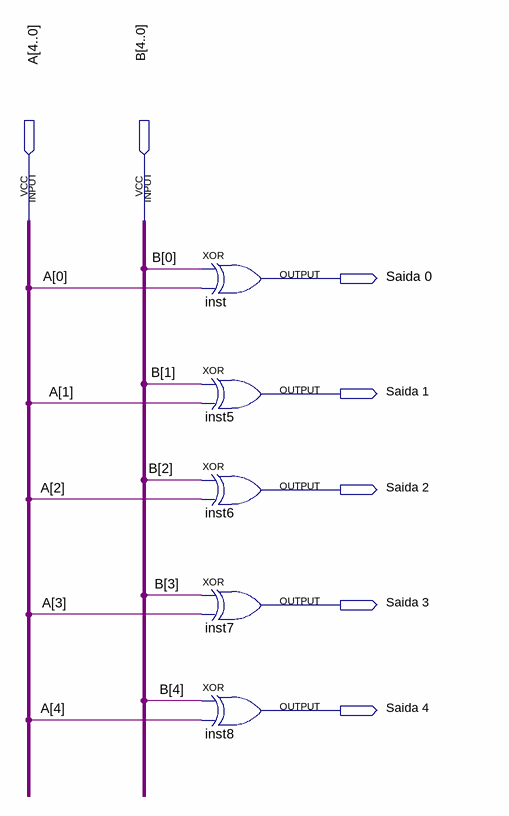
[diagram p0: schematic sheet]
// Quartus schematic Xor.bdf as structural Verilog: 5 symbols, 7 pins
module Xor (
  input  [4:0] A,
  input  [4:0] B,
  output \Saida_0 ,
  output \Saida_1 ,
  output \Saida_2 ,
  output \Saida_3 ,
  output \Saida_4 
);

  xor inst (\Saida_0 , B[0], A[0]);
  xor inst5 (\Saida_1 , B[1], A[1]);
  xor inst6 (\Saida_2 , B[2], A[2]);
  xor inst7 (\Saida_3 , B[3], A[3]);
  xor inst8 (\Saida_4 , B[4], A[4]);
endmodule
